# EAGLE schematic final (EAGLE 9.3.2)
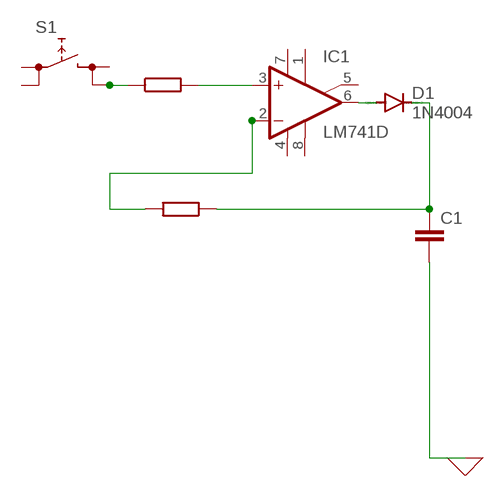
[diagram p0: schematic, sheet 1]

## Parts
C1  C2.5/2  [C2.5-2]
D1  1N4004  [DO41-10]
IC1  LM741D  [SO08]
S1  REKN  [REKN]

## Nets
0: C1.2 ; supply symbol labelled GND
N$1: S1.1B
N$2: IC1.3(+IN)
N$3: IC1.2(-IN)
N$4: C1.1 D1.C
N$5: D1.A IC1.6(OUT)
Unconnected: IC1.1(ON1) IC1.5(ON2) IC1.8(OPT) S1.0A S1.0B S1.1A

## Power pins joined to a net without a drawn wire
V+: IC1.7(V+)
V-: IC1.4(V-)

## Library data of the parts
C1 = capacitor-wima:C: CAPACITOR naming: grid - package width
D1 = diode:1N4004: DIODE general purpose rectifier, 1 A
IC1 = linear:*741: OP AMP
S1 = switch:REKN: PUSH SWITCH ITT-Cannon-Cannon